# EAGLE design Frontboard (EAGLE 9.0.1)
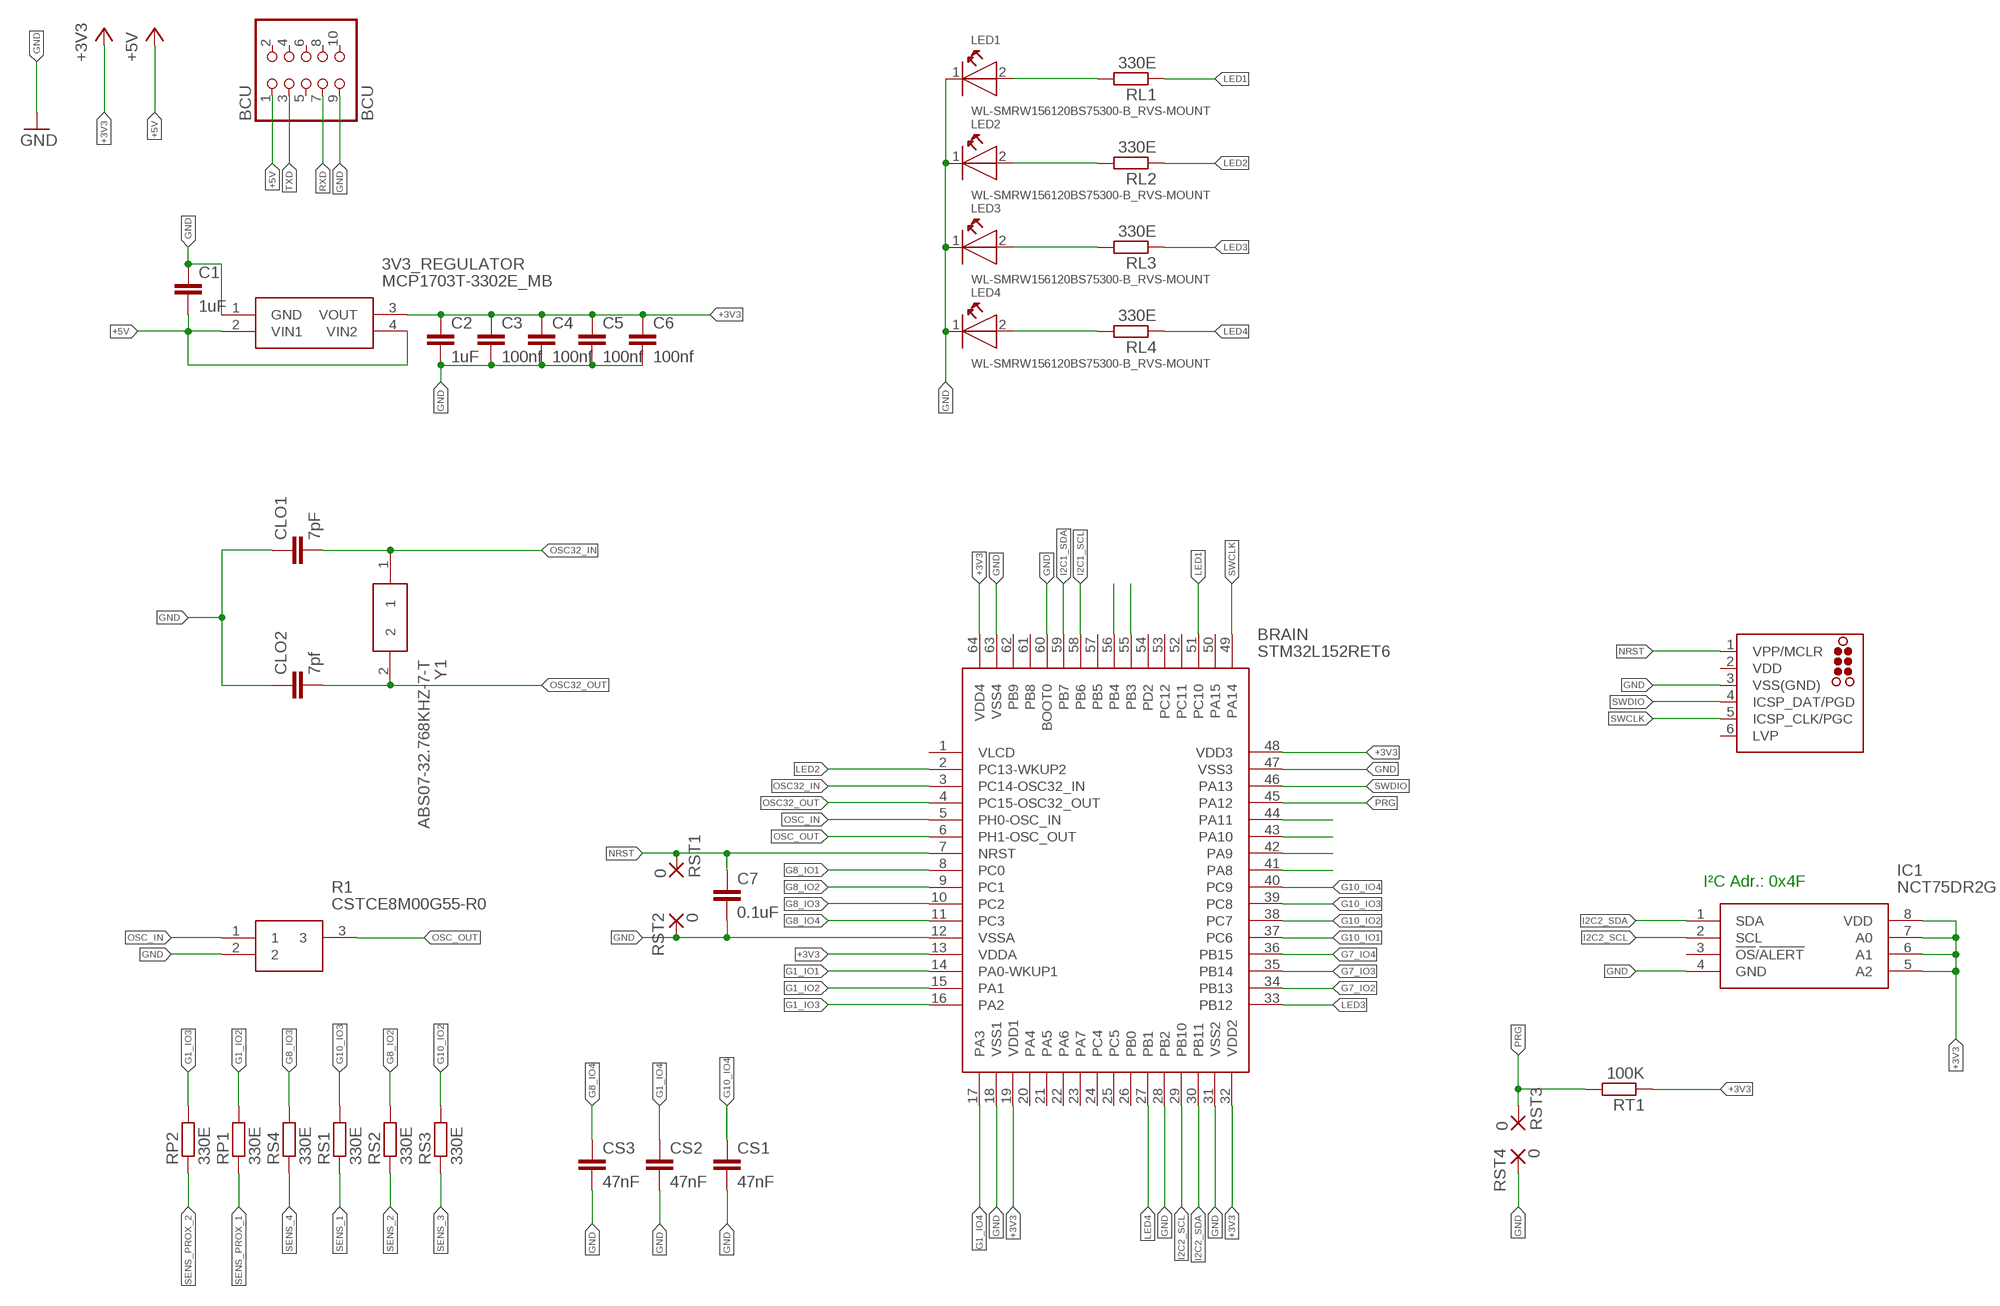
[diagram p0: schematic, sheet 1]

## Parts
3V3_REGULATOR  MCP1703T-3302E_MB  [SOT-89(MB)]
BCU  BCU  PINHD-2X5_2.54-SMD  [2X05SMD]
BRAIN  STM32L152RET6  [QFP50P1200X1200X160-64N]
C1  1uF  C-EUC0603  [C0603]
C2  1uF  C-EUC0603  [C0603]
C3  100nf  C-EUC0603  [C0603]
C4  100nf  C-EUC0603  [C0603]
C5  100nf  C-EUC0603  [C0603]
C6  100nf  C-EUC0603  [C0603]
C7  0.1uF  C-EUC0603  [C0603]
CLO1  7pF  C-EUC0603  [C0603]
CLO2  7pf  C-EUC0603  [C0603]
CS1  47nF  C-EUC0603  [C0603]
CS2  47nF  C-EUC0603  [C0603]
CS3  47nF  C-EUC0603  [C0603]
IC1  NCT75DR2G  [SOIC127P600X175-8N]
LED1  WL-SMRW156120BS75300-B_RVS-MOUNT  [WL-SMRW-1206-CYLDR-REVERSE-MOUNT]
LED2  WL-SMRW156120BS75300-B_RVS-MOUNT  [WL-SMRW-1206-CYLDR-REVERSE-MOUNT]
LED3  WL-SMRW156120BS75300-B_RVS-MOUNT  [WL-SMRW-1206-CYLDR-REVERSE-MOUNT]
LED4  WL-SMRW156120BS75300-B_RVS-MOUNT  [WL-SMRW-1206-CYLDR-REVERSE-MOUNT]
R1  CSTCE8M00G55-R0  [CSTCE12M0G55-R0]
RL1  330E  R-EU_R0603  [R0603]
RL2  330E  R-EU_R0603  [R0603]
RL3  330E  R-EU_R0603  [R0603]
RL4  330E  R-EU_R0603  [R0603]
RP1  330E  R-EU_R0603  [R0603]
RP2  330E  R-EU_R0603  [R0603]
RS1  330E  R-EU_R0603  [R0603]
RS2  330E  R-EU_R0603  [R0603]
RS3  330E  R-EU_R0603  [R0603]
RS4  330E  R-EU_R0603  [R0603]
RST1  0  SMD5  [SMD2,54-5,08]
RST2  0  SMD5  [SMD2,54-5,08]
RST3  0  SMD5  [SMD2,54-5,08]
RST4  0  SMD5  [SMD2,54-5,08]
RT1  100K  R-EU_R0603  [R0603]
SWD  SWD  TC2030-MCP-NL  [TC2030-MCP-NL]
Y1  ABS07-32.768KHZ-7-T  [ABS-07]

## Nets
+3V3: 3V3_REGULATOR.3(VOUT) BRAIN.13(VDDA) BRAIN.19(VDD1) BRAIN.32(VDD2) BRAIN.48(VDD3) BRAIN.64(VDD4) C2.1 C3.1 C4.1 C5.1 C6.1 IC1.5(A2) IC1.6(A1) IC1.7(A0) IC1.8(VDD) RT1.1
+5V: 3V3_REGULATOR.2(VIN1) 3V3_REGULATOR.4(VIN2) BCU.1 C1.2
G1_IO1: BRAIN.14(PA0-WKUP1)
G1_IO2: BRAIN.15(PA1) RP1.2
G1_IO3: BRAIN.16(PA2) RP2.2
G1_IO4: BRAIN.17(PA3) CS2.1
G7_IO2: BRAIN.34(PB13)
G7_IO3: BRAIN.35(PB14)
G7_IO4: BRAIN.36(PB15)
G8_IO1: BRAIN.8(PC0)
G8_IO2: BRAIN.9(PC1) RS2.2
G8_IO3: BRAIN.10(PC2) RS4.2
G8_IO4: BRAIN.11(PC3) CS3.1
G10_IO1: BRAIN.37(PC6)
G10_IO2: BRAIN.38(PC7) RS3.2
G10_IO3: BRAIN.39(PC8) RS1.2
G10_IO4: BRAIN.40(PC9) CS1.1
GND: 3V3_REGULATOR.1(GND) BCU.9 BRAIN.12(VSSA) BRAIN.18(VSS1) BRAIN.28(PB2) BRAIN.31(VSS2) BRAIN.47(VSS3) BRAIN.60(BOOT0) BRAIN.63(VSS4) C1.1 C2.2 C3.2 C4.2 C5.2 C6.2 C7.2 CLO1.1 CLO2.1 CS1.2 CS2.2 CS3.2 IC1.4(GND) LED1.1(K) LED2.1(K) LED3.1(K) LED4.1(K) R1.2 RST2.1(P) RST4.1(P) SWD.3(VSS(GND))
I2C1_SCL: BRAIN.58(PB6)
I2C1_SDA: BRAIN.59(PB7)
I2C2_SCL: BRAIN.29(PB10) IC1.2(SCL)
I2C2_SDA: BRAIN.30(PB11) IC1.1(SDA)
LED1: BRAIN.51(PC10) RL1.1
LED2: BRAIN.2(PC13-WKUP2) RL2.1
LED3: BRAIN.33(PB12) RL3.1
LED4: BRAIN.27(PB1) RL4.1
N$1: BRAIN.55(PB3)
N$2: BRAIN.56(PB4)
N$3: BRAIN.41(PA8)
N$7: BRAIN.42(PA9)
N$8: BRAIN.43(PA10)
N$9: BRAIN.44(PA11)
N$19: LED1.2(A) RL1.2
N$20: LED2.2(A) RL2.2
N$21: LED3.2(A) RL3.2
N$22: LED4.2(A) RL4.2
NRST: BRAIN.7(NRST) C7.1 RST1.1(P) SWD.1(VPP/MCLR)
OSC32_IN: BRAIN.3(PC14-OSC32_IN) CLO1.2 Y1.1
OSC32_OUT: BRAIN.4(PC15-OSC32_OUT) CLO2.2 Y1.2
OSC_IN: BRAIN.5(PH0-OSC_IN) R1.1
OSC_OUT: BRAIN.6(PH1-OSC_OUT) R1.3
PRG: BRAIN.45(PA12) RST3.1(P) RT1.2
RXD: BCU.7
SENS_1: RS1.1
SENS_2: RS2.1
SENS_3: RS3.1
SENS_4: RS4.1
SENS_PROX_1: RP1.1
SENS_PROX_2: RP2.1
SWCLK: BRAIN.49(PA14) SWD.5(ICSP_CLK/PGC)
SWDIO: BRAIN.46(PA13) SWD.4(ICSP_DAT/PGD)
TXD: BCU.3
Unconnected: BCU.2 BCU.4 BCU.5 BCU.6 BCU.8 BCU.10 BRAIN.20(PA4) BRAIN.21(PA5) BRAIN.22(PA6) BRAIN.23(PA7) BRAIN.24(PC4) BRAIN.25(PC5) BRAIN.26(PB0) BRAIN.50(PA15) BRAIN.52(PC11) BRAIN.53(PC12) BRAIN.54(PD2) BRAIN.57(PB5) BRAIN.61(PB8) BRAIN.62(PB9) IC1.3(!OS!/!ALERT) SWD.6(LVP)

## Notes on the sheet
- I²C Adr.: 0x4F

## Power pins joined to a net without a drawn wire
VDD: SWD.2(VDD)
VLCD: BRAIN.1(VLCD)

## Library data of the parts
3V3_REGULATOR = MCP1703T-3302E_MB:MCP1703T-3302E_MB: LDO Low Iq 250mA 16V 3.3V 2% SOT89 Microchip MCP1703T-3302E/MB, LDO Voltage Regulator, 250mA, 3.3 V 2%, 2.7 16 Vin, 3-Pin SOT-89 Source: Datasheet <http://ww1.microchip.com/downloads/en/DeviceDoc/22049f.pdf>; ALLIED_NUMBER: 70047986; ALLIED_PRICE/STOCK: https://www.alliedelec.com/microchip-technology-inc-mcp1703t-3302e-mb/70047986/; ARROW_PART_NUMBER: MCP1703T-3302E/MB; ARROW_PRICE/STOCK: https://www.arrow.com/en/products/mcp1703t-3302emb/microchip-technology; DESCRIPTION: LDO Low Iq 250mA 16V 3.3V 2% SOT89 Microchip MCP1703T-3302E/MB, LDO Voltage Regulator, 250mA, 3.3 V 2%, 2.7 16 Vin, 3-Pin SOT-89; HEIGHT: mm; MANUFACTURER_NAME: Microchip; MANUFACTURER_PART_NUMBER: MCP1703T-3302E/MB; RS_PART_NUMBER: 9122916; RS_PRICE/STOCK: http://uk.rs-online.com/web/p/products/9122916
BCU = pinhead:PINHD-2X5: PIN HEADER
BRAIN = STM32L152RET6:STM32L152RET6: STMICROELECTRONICS - STM32L152RET6 - MCU, 32BIT, CORTEX-M3, 32MHZ, LQFP-64 Source: Datasheet <https://componentsearchengine.com/Datasheets/2/STM32L152RET6.pdf>; ARROW_PART_NUMBER: STM32L152RET6; ARROW_PRICE/STOCK: https://www.arrow.com/en/products/stm32l152ret6/stmicroelectronics; DESCRIPTION: STMICROELECTRONICS - STM32L152RET6 - MCU, 32BIT, CORTEX-M3, 32MHZ, LQFP-64; HEIGHT: 1.6mm; MANUFACTURER_NAME: STMicroelectronics; MANUFACTURER_PART_NUMBER: STM32L152RET6
C1-C7 CLO1 CLO2 CS1-CS3 = rcl:C-EU: CAPACITOR, European symbol; SPICEPREFIX: C
IC1 = NCT75DR2G:NCT75DR2G: Source: Datasheet <http://www.onsemi.com/pub/Collateral/NCT75-D.PDF>; ALLIED_NUMBER: 70467171; ALLIED_PRICE/STOCK: http://www.alliedelec.com/on-semiconductor-nct75dr2g/70467171/; ARROW_PART_NUMBER: NCT75DR2G; ARROW_PRICE/STOCK: https://www.arrow.com/en/products/nct75dr2g/on-semiconductor; HEIGHT: 1.75mm; MANUFACTURER_NAME: ON Semiconductor; MANUFACTURER_PART_NUMBER: NCT75DR2G; RS_PART_NUMBER: 8051854P; RS_PRICE/STOCK: http://uk.rs-online.com/web/p/products/8051854P
LED1-LED4 = Wurth_Elektronik_Optoelectronics_rev15b (1):WL-SMRW: SMD Reverse mount mono-color rectangular Characteristics Small size & thin body for space saving Ideal for narrow space applications Wide viewing angle Low power consumption Industry standard footprint Small package for exceptional brightness To emit light through a small cut-out hole in PCB Compatible with automatic placement machine Applications Front panel indicators LCD backlighting Keypad backlighting Push button backlighting Symbol and switch backlighting General lighting <http://katalog.we-online.de/media/images/eipal/WL-SMRW_pf2.jpg> Details see: http://katalog.we-online.de/en/led/WL-SMRW?m Updated 2015-04-10 2015 (C) Wurth Elektronik
R1 = CSTCE8M00G55-R0:CSTCE8M00G55-R0: SMT ceramic resonator 8.0MHz CSTCE8M00G55-R0, Ceramic Resonator, 8MHz Fundamental 33pF, 3-Pin Cap Chip, 3.2 x 1.3 x 0.7mm Source: Datasheet <http://www.murata.com/en-eu/api/pdfdownloadapi?cate=&partno=CSTCE8M00G55-R0>; ARROW_PART_NUMBER: CSTCE8M00G55-R0; ARROW_PRICE/STOCK: https://www.arrow.com/en/products/cstce8m00g55-r0/murata-manufacturing; DESCRIPTION: SMT ceramic resonator 8.0MHz CSTCE8M00G55-R0, Ceramic Resonator, 8MHz Fundamental 33pF, 3-Pin Cap Chip, 3.2 x 1.3 x 0.7mm; HEIGHT: mm; MANUFACTURER_NAME: Murata Electronics; MANUFACTURER_PART_NUMBER: CSTCE8M00G55-R0; RS_PART_NUMBER: 7214821P; RS_PRICE/STOCK: http://uk.rs-online.com/web/p/products/7214821P
RL1-RL4 RP1 RP2 RS1-RS4 RT1 = rcl:R-EU_: RESISTOR, European symbol; SPICEPREFIX: R
RST1-RST4 = wirepad:SMD5: SMD PAD
SWD = tag-connect:TC2030: TAG-CONNECT ICSP Connector Manufacturer: Tag-Connect <http://www.tag-connect.com> Cable for easy In-Circuit Serial Programming. Designed for Microchip ICD2, suitable for many others. Two variants - one "with legs" (for hands-free fit on PCB) and another "without legs" for quick programming. PAD Description 1 MCLR/Vpp 2 Vdd 3 GND 4 PGD (ISPDAT) 5 PGC (ISPCLK) 6 nc (used for LVP) ©2009 ROFA.cz - modified and updated by Robert Darlington ‹rdarlington@gmail.com›
Y1 = ABS07-32.768KHZ-7-T:ABS07-32.768KHZ-7-T: ABRACON - ABS07-32.768KHZ-7-T - CRYSTAL, 32.768KHZ, 7PF, SMD Source: Datasheet <https://componentsearchengine.com/Datasheets/2/ABS07-32.768KHZ-7-T.pdf>; ARROW_PART_NUMBER: ABS07-32.768KHZ-7-T; ARROW_PRICE/STOCK: https://www.arrow.com/en/products/abs07-32.768khz-7-t/abracon; DESCRIPTION: ABRACON - ABS07-32.768KHZ-7-T - CRYSTAL, 32.768KHZ, 7PF, SMD; HEIGHT: mm; MANUFACTURER_NAME: ABRACON; MANUFACTURER_PART_NUMBER: ABS07-32.768KHZ-7-T; RS_PART_NUMBER: 1712773P; RS_PRICE/STOCK: http://uk.rs-online.com/web/p/products/1712773P

## Board
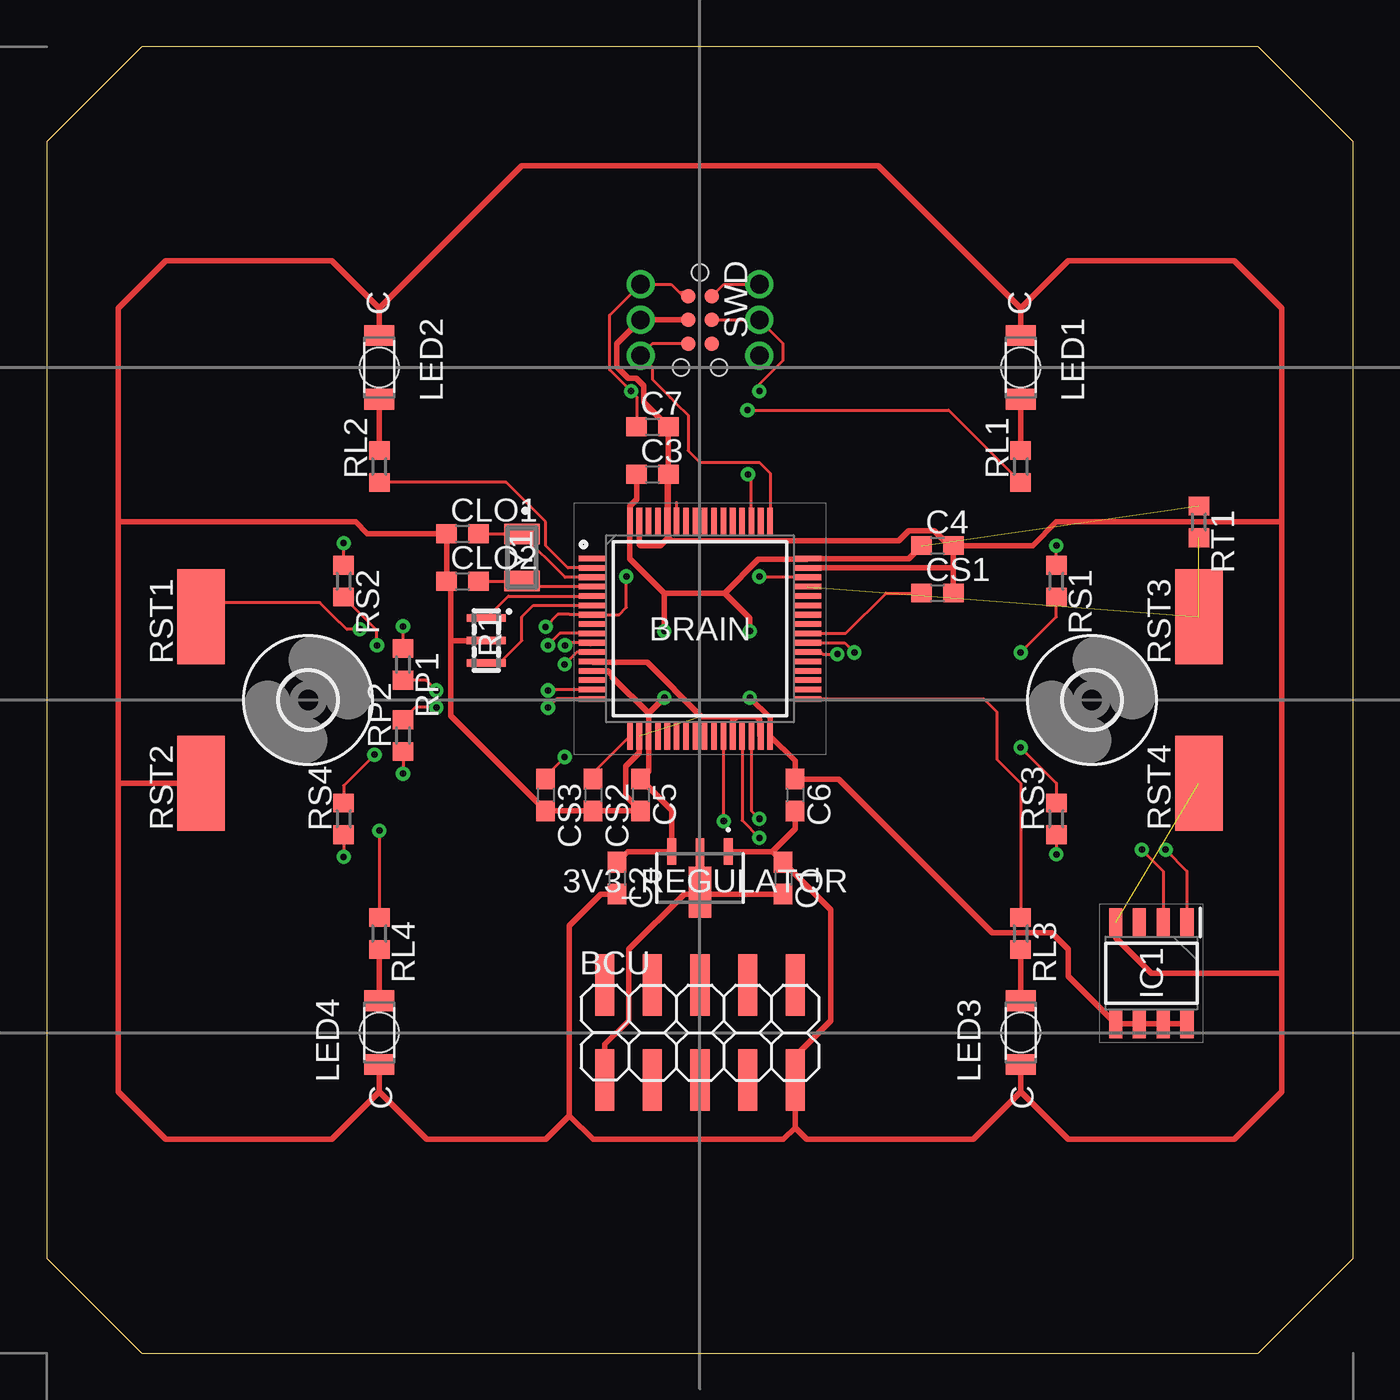
[diagram p1: board, top side]
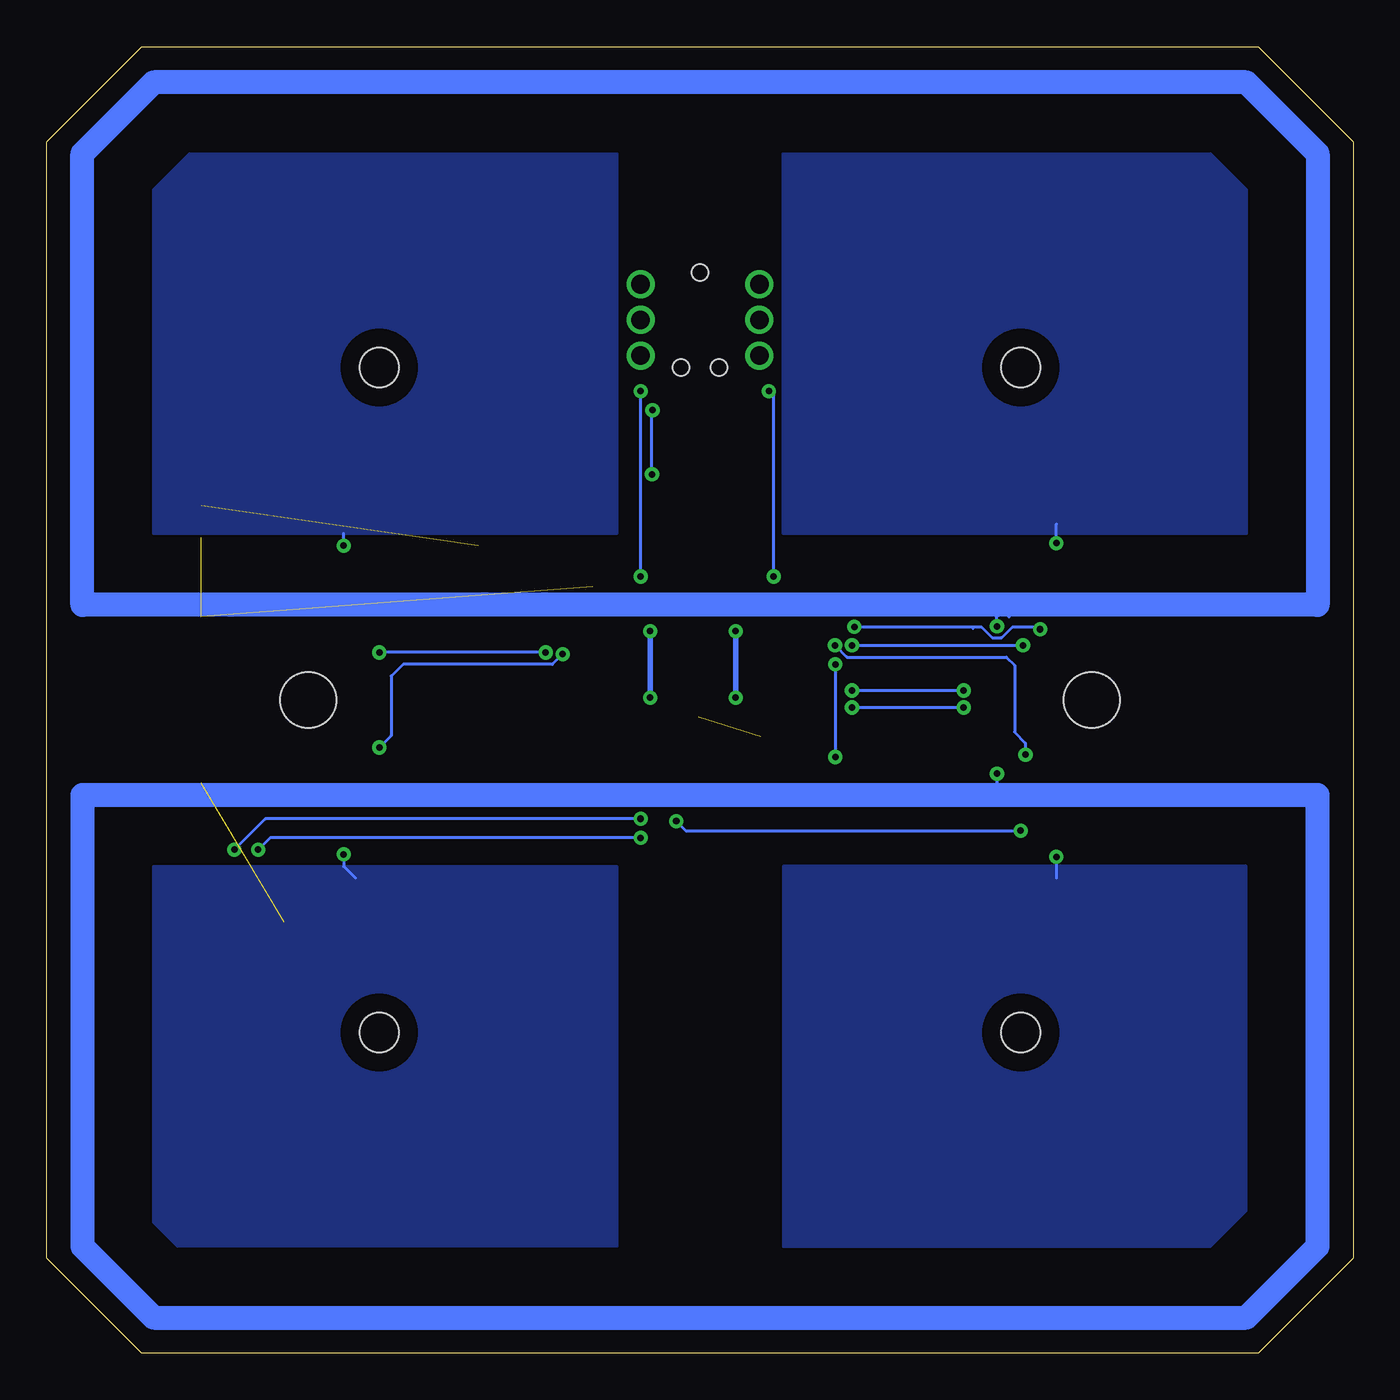
[diagram p2: board, bottom side, seen from below]

Size 69.85 x 69.85 mm. Coordinates in mm from the lower left corner, seen from the top.
Outline: 5.08,69.85 64.77,69.85 69.85,64.77 69.85,5.08 64.77,0 5.08,0 0,5.08 0,64.77 5.08,69.85
Outline: 6.34,69.84 5.08,69.85
Copper layers (1*16): Top 0.035mm / dielectric 1.5mm / Bottom 0.035mm
Design rules "default": minimum track width 6mil, minimum drill 0.35mm, track to track 6mil, track to pad 6mil, pad to pad 6mil, via to via 6mil, smd to smd 6mil, copper to edge 40mil, drill to drill 6mil, minimum pad ring 10mil, minimum via ring 8mil, stop-mask expansion 4mil, vias tented up to drill 0mil, thermal gap 10mil

### Footprints (pad centres in the part's own frame; a part is rotated, then mirrored left to right if it is on the bottom)
SOT-89(MB) = smd 0.48 x 1.4: 1 -1.5,-1.425; 3 1.5,-1.425 | smd 0.48 x 1.525: 2 0,-1.363 | smd 1.2 x 2.725: 4 0,0.76
2X05SMD = smd 1.016 x 3.302: 1 -1.27,-3.81; 2 -1.27,1.27; 3 1.27,-3.81; 4 1.27,1.27; 5 3.81,-3.81; 6 3.81,1.27; 7 6.35,-3.81; 8 6.35,1.27; 9 8.89,-3.81; 10 8.89,1.27
QFP50P1200X1200X160-64N = smd 1.475 x 0.3: 1 -5.738,3.75; 2 -5.738,3.25; 3 -5.738,2.75; 4 -5.738,2.25; 5 -5.738,1.75; 6 -5.738,1.25; 7 -5.738,0.75; 8 -5.738,0.25; 9 -5.738,-0.25; 10 -5.738,-0.75; 11 -5.738,-1.25; 12 -5.738,-1.75; 13 -5.738,-2.25; 14 -5.738,-2.75; 15 -5.738,-3.25; 16 -5.738,-3.75; 33 5.738,-3.75; 34 5.738,-3.25; 35 5.738,-2.75; 36 5.738,-2.25; 37 5.738,-1.75; 38 5.738,-1.25; 39 5.738,-0.75; 40 5.738,-0.25; 41 5.738,0.25; 42 5.738,0.75; 43 5.738,1.25; 44 5.738,1.75; 45 5.738,2.25; 46 5.738,2.75; 47 5.738,3.25; 48 5.738,3.75 | smd 0.3 x 1.475: 17 -3.75,-5.738; 18 -3.25,-5.738; 19 -2.75,-5.738; 20 -2.25,-5.738; 21 -1.75,-5.738; 22 -1.25,-5.738; 23 -0.75,-5.738; 24 -0.25,-5.738; 25 0.25,-5.738; 26 0.75,-5.738; 27 1.25,-5.738; 28 1.75,-5.738; 29 2.25,-5.738; 30 2.75,-5.738; 31 3.25,-5.738; 32 3.75,-5.738; 49 3.75,5.738; 50 3.25,5.738; 51 2.75,5.738; 52 2.25,5.738; 53 1.75,5.738; 54 1.25,5.738; 55 0.75,5.738; 56 0.25,5.738; 57 -0.25,5.738; 58 -0.75,5.738; 59 -1.25,5.738; 60 -1.75,5.738; 61 -2.25,5.738; 62 -2.75,5.738; 63 -3.25,5.738; 64 -3.75,5.738
C0603 = smd 1.1 x 1: 1 -0.85,0; 2 0.85,0
SOIC127P600X175-8N = smd 1.525 x 0.7: 1 -2.712,1.905; 2 -2.712,0.635; 3 -2.712,-0.635; 4 -2.712,-1.905; 5 2.712,-1.905; 6 2.712,-0.635; 7 2.712,0.635; 8 2.712,1.905
WL-SMRW-1206-CYLDR-REVERSE-MOUNT = smd 1.1 x 1.6: 1 -1.7,0; 2 1.7,0 | hole 2.1: 0,0
CSTCE12M0G55-R0 = smd 0.4 x 2.1: 1 -1.2,0; 2 0,0; 3 1.2,0
R0603 = smd 1 x 1.1: 1 -0.85,0; 2 0.85,0
SMD2,54-5,08 = smd 2.54 x 5.08: 1 0,0
TC2030-MCP-NL = smd 0.787 x 0.787: 1 1.27,-0.635; 2 1.27,0.635; 3 2.54,-0.635; 4 2.54,0.635; 5 3.81,-0.635; 6 3.81,0.635 | hole 0.889: 0,0; 5.08,-1.016; 5.08,1.016
3,0 = hole 3: 0,0
ABS-07 = smd 1.1 x 1.9: 1 -1.25,0; 2 1.25,0

### Placement (x,y rotation side)
3V3_REGULATOR  34.92,25.4 180 top
BCU  31.11,18.41 0 top
BRAIN  34.92,38.73 0 top
C1  39.37,25.4 270 top
C2  30.48,25.4 270 top
C3  32.38,46.99 0 top
C4  47.62,43.18 0 top
C5  31.75,29.84 270 top
C6  40.01,29.84 270 top
C7  32.38,49.53 0 top
CLO1  22.23,43.81 0 top
CLO2  22.23,41.27 0 top
CS1  47.62,40.64 0 top
CS2  29.21,29.84 270 top
CS3  26.67,29.84 270 top
IC1  59.05,20.32 270 top
LED1  52.07,52.7 270 top
LED2  17.78,52.7 270 top
LED3  52.07,17.14 90 top
LED4  17.78,17.14 90 top
R1  23.5,38.1 270 top
RL1  52.07,47.41 90 top
RL2  17.78,47.41 90 top
RL3  52.07,22.44 270 top
RL4  17.78,22.44 270 top
RP1  19.05,36.83 270 top
RP2  19.05,33.02 90 top
RS1  53.98,41.27 270 top
RS2  15.88,41.27 270 top
RS3  53.98,28.57 90 top
RS4  15.88,28.57 90 top
RST1  8.26,39.37 0 top
RST2  8.26,30.48 0 top
RST3  61.59,39.37 0 top
RST4  61.59,30.48 0 top
RT1  61.59,44.45 270 top
SWD  34.92,57.78 270 top
U$1  [3,0]  13.97,34.92 0 top
U$2  [3,0]  55.88,34.92 0 top
Y1  25.4,42.55 270 top

### Tracks (layer width: path | path; a pad name or v marks a point on that pad's centre or on a via)
6  (via drill 1)
  other vias: 38.1,53.34
+3V3  (via drill 0.35)  (1 unrouted)
  Top 0.305: C2.1 31.05,26.82 3V3_REGULATOR.3 33.42,29.02 C5.1 32.17,31.12 BRAIN.19 32.17,34.21 | C3.1 31.54,45.65 31.18,45.29 BRAIN.64 31.18,42.48 33.02,40.64 | BRAIN.48 41.22,42.48 | 33.02,40.64 v33.02,38.61 | v33.02,35.05 32.17,34.21 | C4.1 46.08,42.48 BRAIN.48 | v37.59,35.05 38.67,33.97 BRAIN.32 40.01,31.67 C6.1 42.33,30.7 50.55,22.48 53.72,22.48 54.61,21.59 54.61,20.15 IC1.5 IC1.6 IC1.7 IC1.8 | BRAIN.48 40.62,42.44 38.05,42.44 36.24,40.64 | 32.17,34.21 30.23,36.15 30.23,36.26 30.01,36.48 BRAIN.13 | 33.02,40.64 36.24,40.64 | v37.59,38.61 37.59,39.29 36.24,40.64
  Bottom 0.305: v33.02,38.61 v33.02,35.05 | v37.59,35.05 v37.59,38.61
+5V
  Top 0.305: C1.2 35.02,24.55 | BCU.1 29.84,16.51 31.11,17.78 31.11,21.59 34.08,24.55 35.02,24.55 | 3V3_REGULATOR.2 3V3_REGULATOR.4 35.02,24.55
G1_IO2  (via drill 0.35)
  Top 0.152: BRAIN.15 26.85,35.48 v26.8,35.43 | v20.83,35.43 20.28,35.98 RP1.2
  Bottom 0.152: v26.8,35.43 v20.83,35.43
G1_IO3  (via drill 0.35)
  Top 0.152: 29.21,34.96 BRAIN.16 27.26,34.98 v26.8,34.52 | v20.83,34.52 19.7,34.52 RP2.2
  Bottom 0.152: v26.8,34.52 v20.83,34.52
G1_IO4
  Top 0.152: BRAIN.17 29.21,31.03 CS2.1
G8_IO2  (via drill 0.35)
  Top 0.152: BRAIN.9 27.44,38.48 v26.8,37.85 | v17.65,37.85 17.65,38.65 RS2.2
  Bottom 0.152: v26.8,37.85 v17.65,37.85
G8_IO3  (via drill 0.35)
  Top 0.152: 29.07,37.87 BRAIN.10 27.84,37.98 v27.71,37.85 | v17.53,32 15.88,30.35 RS4.2
  Bottom 0.152: v27.71,37.85 27.07,37.21 18.54,37.21 18.11,36.78 18.11,33.21 17.53,32.63 v17.53,32
G8_IO4  (via drill 0.35)
  Top 0.152: BRAIN.11 28.34,37.48 v27.69,36.83 | CS3.1 26.67,30.86 v27.69,31.88
  Bottom 0.152: v27.69,36.83 v27.69,31.88
G10_IO2  (via drill 0.35)
  Top 0.152: BRAIN.38 41.38,37.48 41.49,37.38 v42.27,37.38 | v52.07,32.38 53.98,30.48 RS3.2
  Bottom 0.152: v42.27,37.38 42.82,36.83 50.8,36.83 51.44,36.2 51.44,33.02 v52.07,32.38
G10_IO3  (via drill 0.35)
  Top 0.152: BRAIN.39 42.66,37.98 v43.18,37.47 | v52.07,37.47 53.98,39.37 RS1.2
  Bottom 0.152: v43.18,37.47 v52.07,37.47
G10_IO4
  Top 0.152: BRAIN.40 42.72,38.48 44.87,40.64 CS1.1
GND  (via drill 1)  (2 unrouted)
  Top 0.305: 3V3_REGULATOR.1 38.8,26.82 | 38.8,26.82 C1.1 41.91,23.71 41.91,17.78 40.01,15.88 BCU.9 40.01,12.06 | 40.01,12.06 39.37,11.43 29.21,11.43 27.94,12.7 | C2.2 29.63,24.55 27.94,22.86 27.94,12.7 | 33.22,44.43 BRAIN.60 33.17,46.93 C3.2 | 33.22,44.43 33.22,43.61 | 27.94,12.7 26.67,11.43 20.32,11.43 17.78,13.97 | 40.01,12.06 40.64,11.43 49.53,11.43 52.07,13.97 | 21.72,40.93 CLO2.1 | BRAIN.63 31.68,43.26 31.75,43.18 32.79,43.18 33.22,43.61 | C3.2 C7.2 31.93,50.84 31.93,51.72 31.52,52.12 31.1,52.12 30.48,52.74 30.48,53.98 v31.75,55.24 SWD.3 | CLO2.1 21.59,41.06 21.59,38.1 | CLO2.1 CLO1.1 17.14,43.81 16.51,44.45 3.81,44.45 | R1.2 21.59,38.1 | 52.07,13.97 54.61,11.43 63.5,11.43 66.04,13.97 66.04,20.32 | 66.04,20.32 66.04,44.45 | 66.04,44.45 66.04,55.88 63.5,58.42 54.61,58.42 52.07,55.88 | 3.81,44.45 3.81,55.88 6.35,58.42 15.24,58.42 17.78,55.88 | 3.81,44.45 3.81,30.48 | 3.81,30.48 3.81,13.97 6.35,11.43 15.24,11.43 17.78,13.97 | LED2.1 17.78,55.88 | 17.78,55.88 25.4,63.5 44.45,63.5 52.07,55.88 | LED1.1 52.07,55.88 | RST2.1 3.81,30.48 | LED4.1 17.78,13.97 | LED3.1 52.07,13.97 | CS1.2 48.48,42.04 | 48.48,42.04 C4.2 | BRAIN.47 48.42,41.98 48.48,42.04 | C4.2 52.7,43.18 53.98,44.45 66.04,44.45 | BRAIN.12 29.23,36.94 32.1,36.94 35,34.04 36.58,34.04 36.67,33.94 | BRAIN.28 36.67,33.94 | 36.67,33.94 36.8,33.94 36.9,34.04 37.95,34.04 38.13,33.86 38.13,33.04 BRAIN.31 | BRAIN.18 31.68,32.1 30.95,31.37 30.95,29.8 C5.2 CS2.2 CS3.2 21.59,34.08 21.59,38.1 | 33.22,44.43 33.22,45.34 33.23,45.35 C3.2 | 33.22,43.61 33.4,43.43 45.55,43.43 46.1,43.98 47.45,43.98 48.26,43.18 C4.2 | 38.8,26.82 40.01,28.04 C6.2 | 66.04,20.32 59.05,20.32 57.15,22.23 IC1.4
I2C1_SDA
  Top 0.152: BRAIN.59 33.67,45.49
I2C2_SCL  (via drill 0.35)
  Top 0.152: BRAIN.29 37.17,28.48 v38.1,27.56 | v58.55,26.92 59.69,25.78 IC1.2
  Bottom 0.152: v38.1,27.56 57.91,27.56 v58.55,26.92
I2C2_SDA  (via drill 0.35)
  Top 0.152: BRAIN.30 37.67,29 v38.1,28.57 | v59.82,26.92 60.96,25.78 IC1.1
  Bottom 0.152: v38.1,28.57 58.17,28.57 v59.82,26.92
LED1  (via drill 0.35)
  Top 0.152: BRAIN.51 37.67,46.81 v37.49,46.99 | v37.47,50.42 48.21,50.42 RL1.1
  Bottom 0.152: v37.49,46.99 37.49,50.39 v37.47,50.42
LED2
  Top 0.152: BRAIN.2 27.86,41.98 26.67,43.18 26.67,44.45 24.56,46.56 RL2.1
LED3
  Top 0.152: 52.07,23.58 RL3.1 52.07,30.48 50.8,31.75 50.8,34.29 50.1,34.98 BRAIN.33
LED4  (via drill 0.35)
  Top 0.152: BRAIN.27 36.17,28.47 v36.2,28.45 | v17.78,27.94 RL4.1
  Bottom 0.152: v36.2,28.45 35.69,27.94 v17.78,27.94
N$19
  Top 0.305: LED1.2 RL1.2
N$20
  Top 0.305: LED2.2 RL2.2
N$21
  Top 0.305: LED3.2 RL3.2
N$22
  Top 0.305: LED4.2 RL4.2
NRST  (via drill 0.35, 1)
  Top 0.152: v26.67,38.84 27.33,39.5 27.94,39.5 27.95,39.48 BRAIN.7 30.59,39.48 30.99,39.88 v30.99,41.53 | C7.1 31.54,51.14 v31.24,51.44 30.1,52.58 30.1,55.5 v31.75,57.15 33.39,57.15 33.84,56.7 | 33.84,56.7 34.16,56.38 | SWD.1 34.11,56.7 33.84,56.7 | v16.73,38.71 16.04,38.71 15.69,39.06 15.67,39.06 14.61,40.13 9.02,40.13 RST1.1
  Bottom 0.152: v26.67,38.84 20.42,38.84 | 20.42,38.84 20.32,38.73 | v30.99,41.53 30.99,51.31 31.11,51.44 v31.24,51.44 | v16.73,38.71 16.87,38.84 18.21,38.84 18.8,38.26 19.3,38.26 19.89,38.84 20.42,38.84
OSC32_IN
  Top 0.152: BRAIN.3 27.71,41.48 Y1.1 25.38,43.81 CLO1.2
  Top 0.305: 23.09,43.8 CLO1.2
OSC32_OUT
  Top 0.152: BRAIN.4 25.71,40.98 25.41,41.28 | 25.41,41.28 Y1.2 | CLO2.2 25.4,41.27 25.41,41.28
  Top 0.305: 23.09,41.3 CLO2.2
OSC_IN
  Top 0.152: R1.1 24.68,40.48 BRAIN.5
OSC_OUT
  Top 0.152: R1.3 24.2,36.9 25.4,38.1 25.4,39.37 26.02,39.98 BRAIN.6
PRG  (2 unrouted)
SENS_1  (via drill 0.35)
  Top 0.152: RS1.1 v53.98,43.18
  Bottom 0.152: v53.98,43.18 53.98,43.81
  pour Bottom: 39.37,43.81 64.14,43.81 64.14,62.23 62.23,64.14 39.37,64.14
SENS_2  (via drill 0.35)
  Top 0.152: RS2.1 v15.88,43.31
  Bottom 0.152: v15.88,43.31 15.88,44.32
  pour Bottom: 5.71,62.23 5.71,43.81 30.48,43.81 30.48,64.14 7.62,64.14
SENS_3  (via drill 0.35)
  Top 0.152: RS3.1 v53.98,26.67
  Bottom 0.152: 53.34,25.4 53.66,25.72 53.98,26.04 v53.98,26.67
  pour Bottom: 39.37,5.71 62.87,5.71 64.14,6.99 64.14,26.04 39.37,26.04
SENS_4  (via drill 0.35)
  Top 0.152: RS4.1 v15.88,26.54
  Bottom 0.152: v15.88,26.54 15.88,25.4
  pour Bottom: 5.71,26.04 30.48,26.04 30.48,5.71 7.62,5.71 5.71,7.62
SENS_PROX_1  (via drill 0.35)
  Top 0.152: RP1.1 v19.05,38.86
  Bottom 0.152: 18.41,39.37 18.99,39.94 | 18.99,39.94 19.05,40.01 | v19.05,38.86 19.05,39.88 18.99,39.94
  Bottom 1.27: 5.71,67.94 64.14,67.94 67.94,64.14 67.94,40.01 19.05,40.01 1.91,40.01 1.91,64.14 5.71,67.94
SENS_PROX_2  (via drill 0.35)
  Top 0.152: RP2.1 v19.05,30.99
  Bottom 0.152: v19.05,30.99 19.05,29.84
  Bottom 1.27: 64.14,1.91 5.71,1.91 1.91,5.71 1.91,29.84 19.05,29.84 67.94,29.84 67.94,5.71 64.14,1.91
SWCLK  (via drill 1)
  Top 0.152: SWD.5 32.38,53.98 v31.75,53.34 32.37,52.72 32.37,52.07 33.33,51.11 33.64,50.8 34.29,50.15 34.29,48.26 34.92,47.62 38.1,47.62 38.67,47.05 BRAIN.49
SWDIO  (via drill 0.35, 1)
  Top 0.152: BRAIN.46 38.14,41.48 v38.1,41.53 | v38.1,51.44 38.1,51.82 39.37,53.09 39.37,53.98 v38.1,55.24 SWD.4
  Bottom 0.152: v38.1,41.53 v38.1,51.44
VDD  (via drill 1)
  Top 0.152: SWD.2 36.2,57.15 v38.1,57.15